# Altium schematic sheet MotorCircuit.SchDoc
size A4
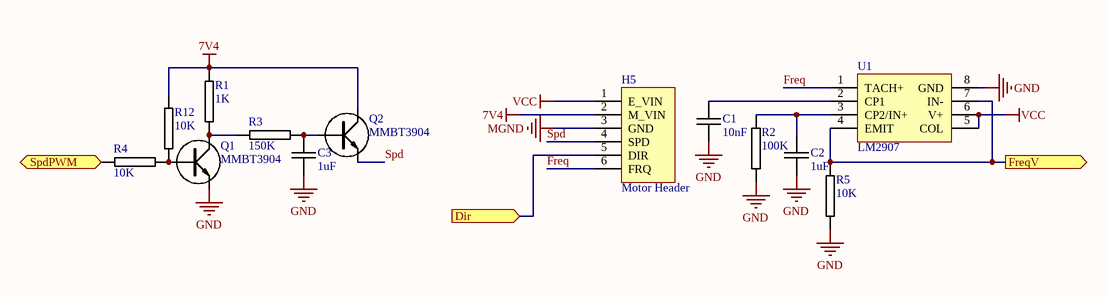
[diagram p0: MotorCircuit.SchDoc]

## Parts
C1  10nF  [0805C-TBD]
C2  1uF  [0805C-GENERIC]
C3  1uF  [0805C-GENERIC]
H5  Motor Header  [Motor Header]
Q1  MMBT3904  [SOT23-BCE]
Q2  MMBT3904  [SOT23-BCE]
R1  1K  [0805R-1K]
R2  100K  [0805R-100K]
R3  150K  [0805R-150K]
R4  10K  [0805R-10K]
R5  10K  [0805R-10K]
R12  10K  [0805R-10K]
U1  LM2907  [LM2907]

## Ports
Dir (in), FreqV (out), SpdPWM (in)

## Nets
7V4: H5.2(M_VIN) Q2.C R1.1 R12.2
GND: C1.2 C2.2 C3.2 Q1.E R2.2 R5.2 U1.8(GND)
MGND: H5.3(GND)
VCC: H5.1(E_VIN) U1.5(COL) U1.6(V+)
Dir: H5.5(DIR) ; port Dir
Freq: H5.6(FRQ) U1.1(TACH+)
FreqV: R5.1 U1.4(EMIT) U1.7(IN-) ; port FreqV
Spd: H5.4(SPD) Q2.E
SpdPWM: R4.1 ; port SpdPWM
NetC1_1: C1.1 U1.2(CP1)
NetC2_1: C2.1 R2.1 U1.3(CP2/IN+)
NetC3_1: C3.1 Q2.B R3.2
NetQ1_B: Q1.B R4.2 R12.1
NetQ1_C: Q1.C R1.2 R3.1

## Library data of the parts
C1 = 0805C-100nF-25V-X7R-MUR: CAPACITOR 0805 CERAMIC; Supplier 1: Digi-Key; Supplier Part Number 1: 490-1673-1-ND
C2 = 0805C-10UF-6V3-X5R-PAN: CAPACITOR 0805 CERAMIC; Manufacturer: Panasonic - ECG; Manufacturer Part Number: ECJ-2FB0J106M; Reel: C1; Capacitance: 10µF; Voltage - Rated: 6.3V; Temperature Coefficient: X5R; Tolerance: ±20%; Supplier 1: Digi-Key; Supplier Part Number 1: PCC2225TR-ND; Supplier: Digi-Key; Operating Temperature: -55°C ~ 85°C; Mounting Type: Surface Mount, MLCC; Lead Spacing: -; RoHS: RoHS Compliant; Packaging: Tape & Reel (TR); Thickness: 1.25mm; Package / Case: 0805 (2012 metric); Features: General Purpose; Category: Capacitors; Supplier Part Number: PCC2225TR-ND
C3 = 0805C-2U2-6V3-X5R-PAN: CAPACITOR 0805 CERAMIC; Manufacturer Part Number: ECJ-1VB0J225K; Manufacturer: Panasonic - ECG; Reel: C7; Supplier 1: Digi-Key; Supplier Part Number 1: PCC2273TR-ND
Q1 Q2 = MMBT2222: BC847 SMALL SIGNAL NPN TRANSISTOR; Supplier 1: Digi-Key; Supplier Part Number 1: MMBT2222A-FDICT-ND
R1 = 0805R-1K: RESISTOR 0805 1/4 WATT THIN FILM; Reel: *
R2 = 0805R-100K: RESISTOR 0805 1/4 WATT THIN FILM; Reel: *; Supplier 1: Digi-Key; Supplier Part Number 1: RMCF0805FT100KTR-ND
R3 = 0805R-150K: RESISTOR 0805 1/4 WATT THIN FILM; Reel: *
R4 R5 R12 = 0805R-10K: RESISTOR 0805 1/4 WATT THIN FILM; Reel: *
U1 = LM2907: Freq to Voltage Converter